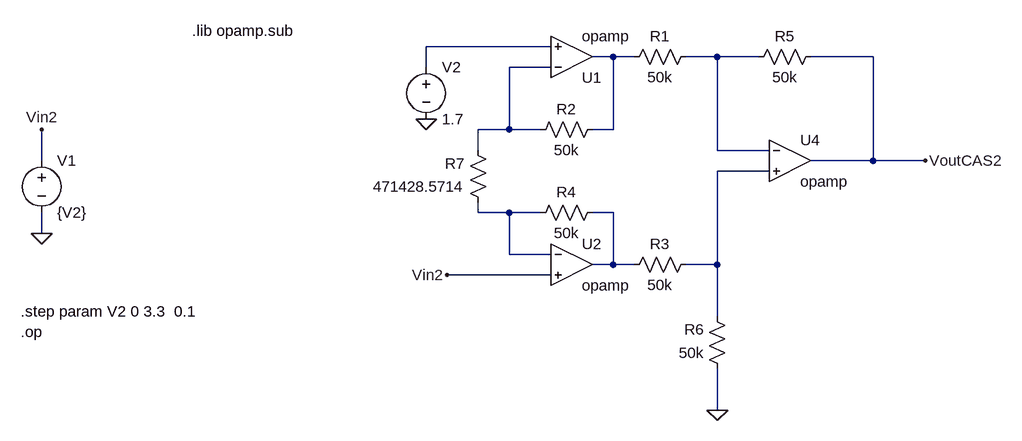
[diagram p0: schematic Draft3.asc]
Draft3.asc, the LTspice schematic file:
Version 4
SHEET 1 880 680
WIRE -496 -560 -688 -560
WIRE -400 -544 -432 -544
WIRE -368 -544 -400 -544
WIRE -240 -544 -288 -544
WIRE -176 -544 -240 -544
WIRE 0 -544 -96 -544
WIRE -688 -528 -688 -560
WIRE -496 -528 -560 -528
WIRE -560 -432 -560 -528
WIRE -560 -432 -608 -432
WIRE -512 -432 -560 -432
WIRE -400 -432 -400 -544
WIRE -400 -432 -432 -432
WIRE -608 -400 -608 -432
WIRE -240 -400 -240 -544
WIRE -160 -400 -240 -400
WIRE -1280 -384 -1280 -432
WIRE 0 -384 0 -544
WIRE 0 -384 -96 -384
WIRE 80 -384 0 -384
WIRE -160 -368 -240 -368
WIRE -608 -304 -608 -320
WIRE -560 -304 -608 -304
WIRE -512 -304 -560 -304
WIRE -400 -304 -432 -304
WIRE -1280 -272 -1280 -304
WIRE -560 -240 -560 -304
WIRE -496 -240 -560 -240
WIRE -400 -224 -400 -304
WIRE -400 -224 -432 -224
WIRE -368 -224 -400 -224
WIRE -240 -224 -240 -368
WIRE -240 -224 -288 -224
WIRE -496 -208 -656 -208
WIRE -240 -144 -240 -224
WIRE -240 0 -240 -64
FLAG -240 0 0
FLAG -656 -208 Vin2
FLAG 80 -384 VoutCAS2
FLAG -1280 -272 0
FLAG -1280 -432 Vin2
FLAG -688 -448 0
SYMBOL Opamps\\opamp -464 -480 M180
SYMATTR InstName U1
SYMBOL res -384 -528 R270
WINDOW 0 32 56 VTop 2
WINDOW 3 0 56 VBottom 2
SYMATTR InstName R1
SYMATTR Value 50k
SYMBOL res -528 -416 R270
WINDOW 0 32 56 VTop 2
WINDOW 3 0 56 VBottom 2
SYMATTR InstName R2
SYMATTR Value 50k
SYMBOL Opamps\\opamp -464 -288 R0
SYMATTR InstName U2
SYMBOL res -384 -208 R270
WINDOW 0 32 56 VTop 2
WINDOW 3 0 56 VBottom 2
SYMATTR InstName R3
SYMATTR Value 50k
SYMBOL res -528 -288 R270
WINDOW 0 32 56 VTop 2
WINDOW 3 0 56 VBottom 2
SYMATTR InstName R4
SYMATTR Value 50k
SYMBOL res -80 -560 R90
WINDOW 0 0 56 VBottom 2
WINDOW 3 32 56 VTop 2
SYMATTR InstName R5
SYMATTR Value 50k
SYMBOL res -224 -48 R180
WINDOW 0 36 76 Left 2
WINDOW 3 36 40 Left 2
SYMATTR InstName R6
SYMATTR Value 50k
SYMBOL res -592 -304 R180
WINDOW 0 36 76 Left 2
WINDOW 3 36 40 Left 2
SYMATTR InstName R7
SYMATTR Value 471428.5714
SYMBOL voltage -1280 -400 R0
SYMATTR InstName V1
SYMATTR Value {V2}
SYMBOL voltage -688 -544 R0
WINDOW 123 0 0 Left 2
WINDOW 39 0 0 Left 2
SYMATTR InstName V2
SYMATTR Value 1.7
SYMBOL Opamps\\opamp -128 -448 R0
SYMATTR InstName U4
TEXT -1312 -152 Left 2 !.step param V2 0 3.3  0.1\n.op
TEXT -1048 -584 Left 2 !.lib opamp.sub

The netlist it stands for:
* Draft3.asc
XU1 N004 N001 N002 opamp Aol=100K GBW=10Meg  ; pins invin noninvin out
R1 N002 N003 50k
R2 N004 N002 50k
XU2 N006 Vin2 N007 opamp Aol=100K GBW=10Meg  ; pins invin noninvin out
R3 N007 N005 50k
R4 N006 N007 50k
R5 VoutCAS2 N003 50k
R6 0 N005 50k
R7 N006 N004 471428.5714
V1 Vin2 0 {V2}
V2 N001 0 1.7
XU4 N003 N005 VoutCAS2 opamp Aol=100K GBW=10Meg  ; pins invin noninvin out
.step param V2 0 3.3  0.1
.op
.lib opamp.sub
.backanno
.end